# EAGLE schematic Qwiic_Adaptive_Switch_Output1.1 (EAGLE 9.6.2)
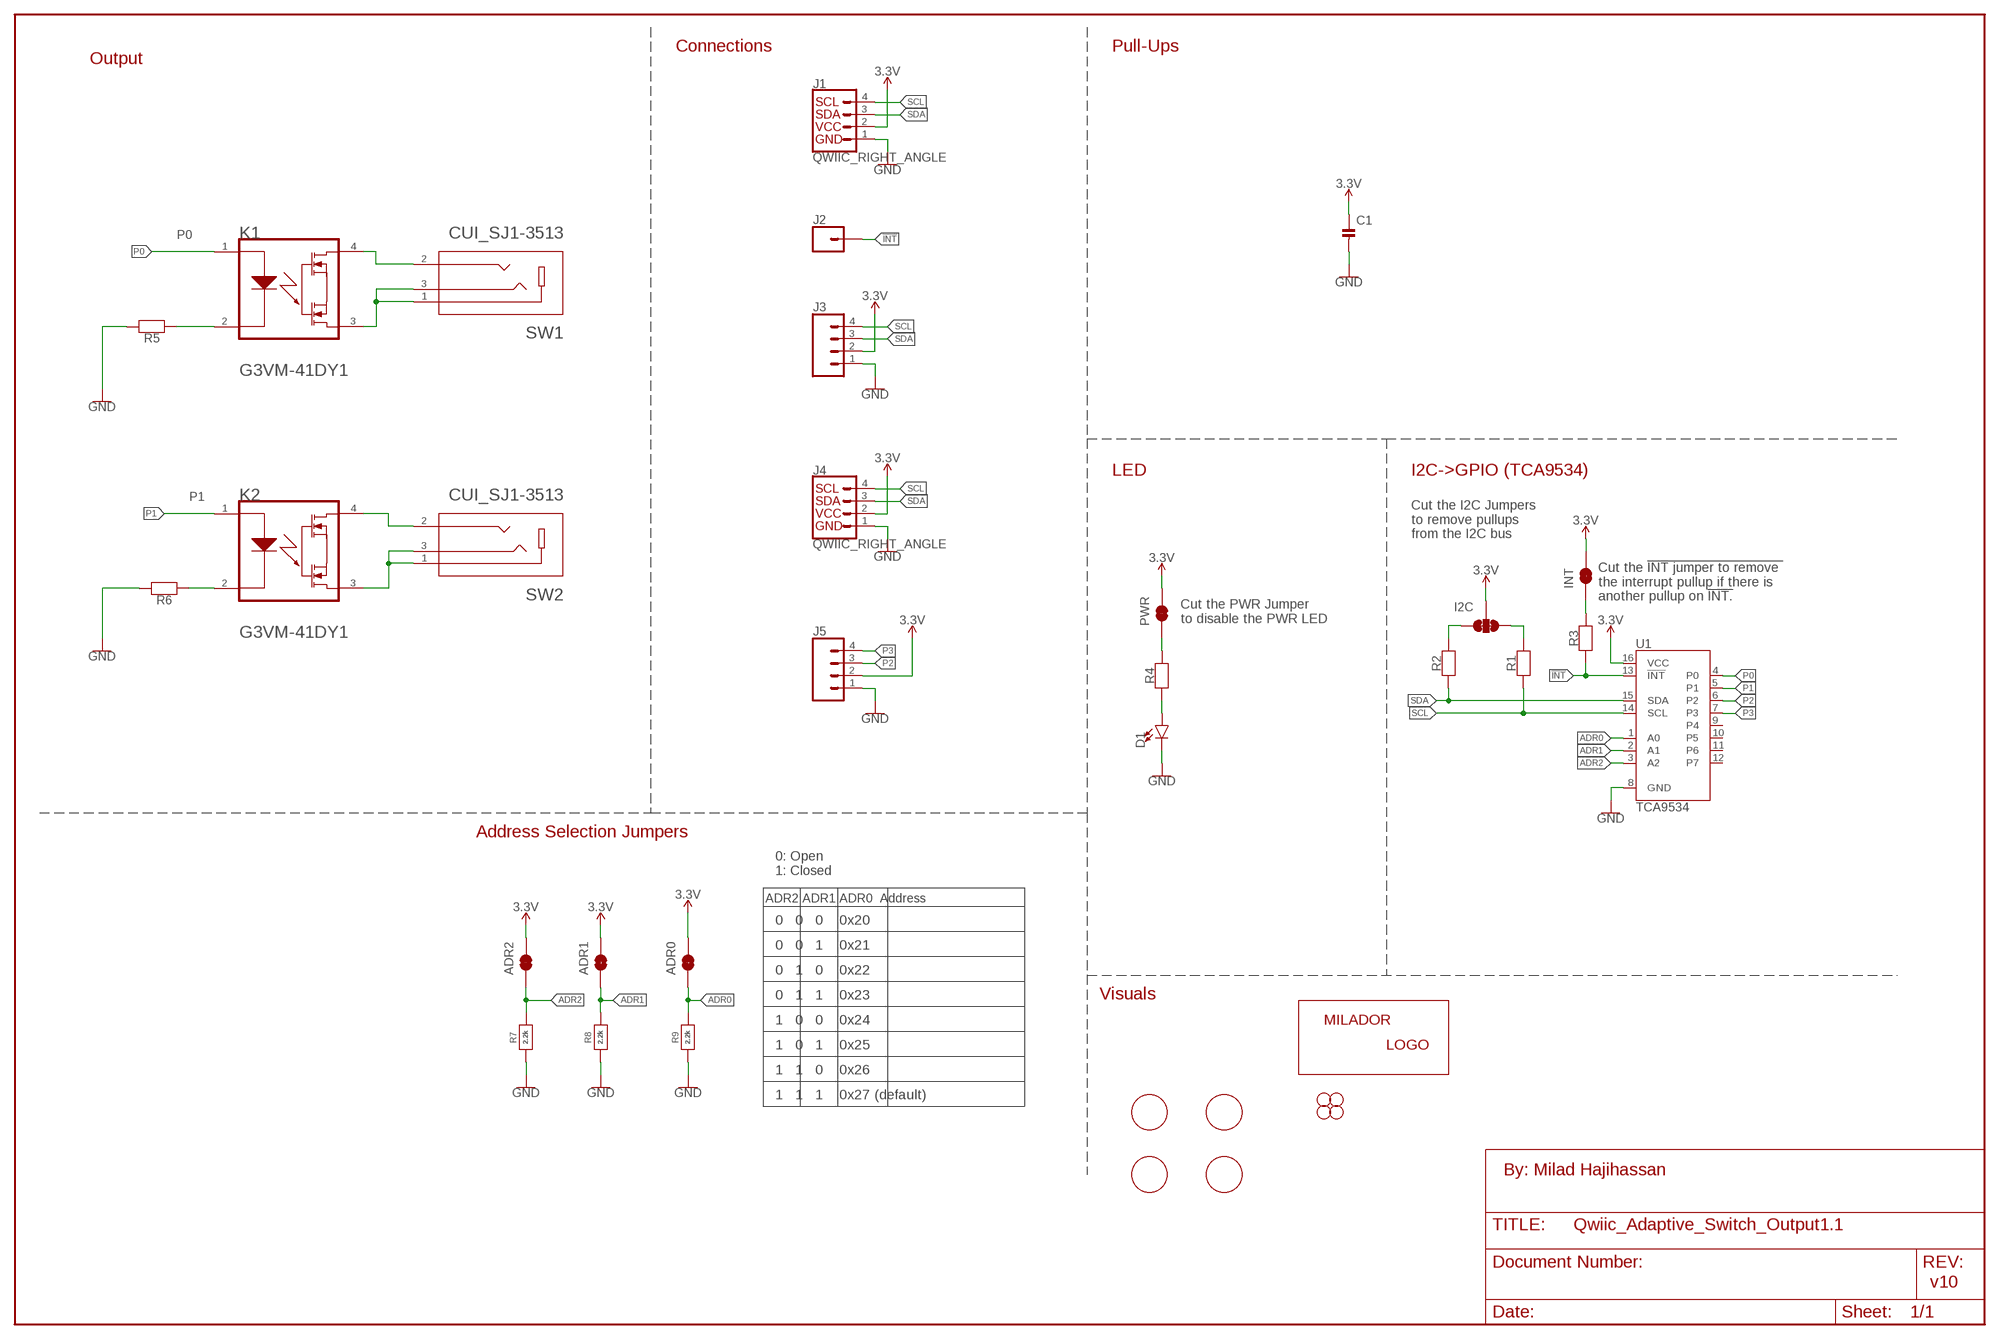
[diagram p0: schematic, sheet 1]

## Parts
ADR0  JUMPERS-SMT_2_NC_TRACE_SILK  [JUMPERS_SMT-JUMPER_2_NC_TRACE_SILK]
ADR1  JUMPERS-SMT_2_NC_TRACE_SILK  [JUMPERS_SMT-JUMPER_2_NC_TRACE_SILK]
ADR2  JUMPERS-SMT_2_NC_TRACE_SILK  [JUMPERS_SMT-JUMPER_2_NC_TRACE_SILK]
C1  0.1uF  CAP_CERAMIC-0805-MP  [0805-MP]
D1  RED  LED0805_NOOUTLINE  [CHIPLED_0805_NOOUTLINE]
H1  STAND-OFF-3.3  [STAND-OFF-3.3]
H2  STAND-OFF-3.3  [STAND-OFF-3.3]
I2C  JUMPERS_JUMPER-SMT_3_2-NC_TRACE_SILK  [JUMPERS_SMT-JUMPER_3_2-NC_TRACE_SILK]
INT  JUMPERS-SMT_2_NC_TRACE_SILK  [JUMPERS_SMT-JUMPER_2_NC_TRACE_SILK]
J1  QWIIC_RIGHT_ANGLE  QWIIC_CONNECTORSJS-1MM  [CONNECTORS_JST04_1MM_RA]
J2  CONNECTORS_CONN_01PTH_NO_SILK_YES_STOP  [CONNECTORS_1X01_NO_SILK]
J3  CONNECTORS_CONN_041X04_NO_SILK  [CONNECTORS_1X04_NO_SILK]
J4  QWIIC_RIGHT_ANGLE  QWIIC_CONNECTORSJS-1MM  [CONNECTORS_JST04_1MM_RA]
J5  CONNECTORS_CONN_041X04_NO_SILK  [CONNECTORS_1X04_NO_SILK]
JP3  STAND-OFF-3.3  [STAND-OFF-3.3]
JP4  STAND-OFF-3.3  [STAND-OFF-3.3]
K1  G3VM-41DY1  [G3VM-41DY1]
K2  G3VM-41DY1  [G3VM-41DY1]
LABEL_2  MILADOR-SWITCH-NAME-SW1  [SWITCH-SW1]
LABEL_3  MILADOR-SWITCH-NAME-SW2  [SWITCH-SW2]
LABEL_9  MILADOR-SWITCH-NAME-SW-OUTPUT  [SWITCH-OUTPUT]
LABEL_13  MILADOR-LOGO-  [MILADOR_LOGO1]
LABEL_18  MILADOR-SWITCH-NAME-SW-OUTPUT  [SWITCH-OUTPUT]
PWR  JUMPERS-SMT_2_NC_TRACE_SILK  [JUMPERS_SMT-JUMPER_2_NC_TRACE_SILK]
R1  2.2k  RESISTOR-0805-MP  [0805-MP]
R2  2.2k  RESISTOR-0805-MP  [0805-MP]
R3  10k  RESISTOR-0805-MP  [0805-MP]
R4  1k  RESISTOR-0805-MP  [0805-MP]
R5  220  RESISTOR-0805-MP  [0805-MP]
R6  220  RESISTOR-0805-MP  [0805-MP]
R7  2.2k  RESISTOR-0805-MP  [0805-MP]
R8  2.2k  RESISTOR-0805-MP  [0805-MP]
R9  2.2k  RESISTOR-0805-MP  [0805-MP]
SW1  CUI_SJ1-3513  [CUI_SJ1-3513]
SW2  CUI_SJ1-3513  [CUI_SJ1-3513]
U1  TCA9534  TCA9534DWR  [16SOIC]

## Nets
3.3V: ADR0.2 ADR1.2 ADR2.2 C1.1 I2C.2 INT.2 J1.2 J3.2 J4.2 J5.2 PWR.2 U1.16(VCC)
!INT: J2.1 R3.1 U1.13(!INT)
ADR0: ADR0.1 R9.2 U1.1(A0)
ADR1: ADR1.1 R8.2 U1.2(A1)
ADR2: ADR2.1 R7.2 U1.3(A2)
GND: C1.2 D1.C J1.1 J3.1 J4.1 J5.1 R5.2 R6.2 R7.1 R8.1 R9.1 U1.8(GND)
N$1: INT.1 R3.2
N$2: D1.A R4.1
N$3: PWR.1 R4.2
N$4: K1.4 SW1.2
N$5: K1.2 R5.1
N$6: K1.3 SW1.1 SW1.3
N$7: K2.2 R6.1
N$8: K2.4 SW2.2
N$9: K2.3 SW2.1 SW2.3
P0: K1.1 U1.4(P0)
P1: K2.1 U1.5(P1)
P2: J5.3 U1.6(P2)
P3: J5.4 U1.7(P3)
SCL: J1.4 J3.4 J4.4 R1.1 U1.14(SCL)
SCL_PU1: I2C.1 R2.2
SDA: J1.3 J3.3 J4.3 R2.1 U1.15(SDA)
SDA_PU1: I2C.3 R1.2
Unconnected: U1.9(P4) U1.10(P5) U1.11(P6) U1.12(P7)

## Notes on the sheet
- Connections | Pull-Ups
- Output
- LED | I2C->GPIO (TCA9534)
- Cut the I2C Jumpers 
  to remove pullups 
  from the I2C bus
- Cut the !INT jumper to remove 
  the interrupt pullup if there is 
  another pullup on !INT.
- Cut the PWR Jumper
  to disable the PWR LED
- Address Selection Jumpers
- 0: Open
  1: Closed
- ADR2 ADR1 ADR0  Address
- 0   0   0    0x20
- 0   0   1    0x21
- 0   1   0    0x22
- 0   1   1    0x23 | Visuals
- 1   0   0    0x24
- 1   0   1    0x25
- 1   1   0    0x26
- 1   1   1    0x27 (default)
- By: Milad Hajihassan
- v10

## Library data of the parts
ADR0 ADR1 ADR2 INT PWR = milador_SMD:JUMPERS-SMT_2_NC_TRACE: Normally closed trace jumper This jumper has a trace between two pads so it's normally closed (NC). Use a razor knife to open the connection. For best results follow the IPC guidelines for cutting traces: Cutout at least 0.063 mm (0.005 in). Remove all loose material to clean up the cut area. Seal the cut with an approved epoxy. Reapply solder to reclose the connection.
C1 = milador_SMD:CAP_CERAMIC-: Ceramic Capacitors For new designs, use the packages preceded by an '_' character since they are more reliable: The following footprints should be used on most boards: _0402 - Standard footprint for regular board layouts _0603 - Standard footprint for regular board layouts _0805 - Standard footprint for regular board layouts _1206 - Standard footprint for regular board layouts For extremely tight-pitch boards where space is at a premium, the following 'micro-pitch' footprints can be used (smaller pads, no silkscreen outline, etc.): _0402MP - Micro-pitch footprint for very dense/compact boards _0603MP - Micro-pitch footprint for very dense/compact boards _0805MP - Micro-pitch footprint for very dense/compact boards _1206MP - Micro-pitch footprint for very dense/compact boards
D1 = milador_SMD:LED: LED 0603 - 0603 Surface Mount Package 2mA: Green LED - Low Power (3.9mcd, 2ma, 1.7Vf) - Digikey: 475-2709-2-ND Orange LED - Low Power (9.8mcd, 2ma, 1.8Vf) - Digikey: 475-1194-2-ND Red LED - Low Power (5mcd, 2ma, 1.8Vf) - Digikey: 475-1195-2-ND Yellow LED - Low Power (7mcd, 2ma, 1.8Vf) - Digikey: 475-1196-2-ND 5mA: Blue LED - Low Power (17mcd, 5ma, 2.9Vf) - Digikey: LNJ937W8CRACT-ND 0805 - 0805 Surface Mount Package 2mA: Red LED (8.8mcd, 2mA, 1.8Vf, Clear) - Low Power [Digikey: 475-2510-1-ND] Green LED (5mcd, 2mA, 1.8Vf, Clear) - Low Power [Digikey: 475-2730-1-ND] Yellow LED (11.3mcd, 2mA, 1.8Vf, Clear) - Low Power [Digikey: 475-2555-1-ND] 20mA: Red LED (104mcd, 20mA, Diffused) - LS R976 [Digikey: 475-1278-6-ND] Red LED (12mcd, 20mA, 2.0Vf, Clear) - APT2012EC [Digikey: 754-1128-1-ND] Green LED (15mcd, 20mA, 2.2Vf, Clear) - APT2012GC [Digikey: 754-1131-1-ND] Orange LED (160mcd, 20mA, 2.1Vf, Clear) - APT2012SECK [Digikey: 754-1130-1-ND] 1206 - 1206 Surface Mount Package Green LED (26mcd, 20mA, Diffused) - LG N971 [Digikey: 475-1407-6-ND] Red LED (15mcd, 20mA, Diffused) - LH N974 [Digikey: 475-1416-6-ND] Cree - Cree High-Power Surface Mount LEDs XPEBWT-L1-0000-00D50 - White 111lm 350mA 2.9Vf 6200K 110° XTEAWT-00-0000-00000LEE3 - White 114lm 350mA 2.85Vf 5000K 115° Everlight - Everlight 45-21 Series Surface Mount LEDs 45-21/QK2C-B2832AC2CB2/2T - Warm White 2000mcd 20mA 3.25Vf 3050K 120° 45-21/LK2C-B38452C4CB2/2T - Nuetral White 2000mcd 20mA 3.25Vf 4150K 120° 45-21/LK2C-B50634C6CB2/2T - Cold White 2200mcd 20mA 3.25Vf 5650K 120° PLCC2 Reverse Mount LS T77K-J1L2-1-0-2-R18-Z - Red 11.25mcd 2mA 1.8Vf 630nm 120° LO T77K-L1M2-24-Z - Orange 19.6mcd 2mA 1.8Vf 606nm 120° LY T77K-K2M1-26-Z - Yellow 15.7mcd 2mA 1.8Vf 587nm 120°
H1 H2 JP3 JP4 = milador:STAND-OFF-: Stand Off Drill holes for mechanically mounting via screws, standoffs, etc. Note: Use the keepout ring to avoid running the screw head into surrounding components. Variant Overviews STAND-OFF - Mechanical footprint for a #4 phillips button head screw. STAND-OFF-TIGHT - Mechanical footprint for a #4 phillips button head screw, Example SparkFun Products Screw - Phillips Head (1/4", 4-40, 10 pack) <https://www.sparkfun.com/products/10453> (PRT-10453) Screw - Phillips Head (1/2", 4-40, 10 pack) <https://www.sparkfun.com/products/10452> (PRT-10452) Screw - Phillips Head (3/4", 4-40, 10 pack) <https://www.sparkfun.com/products/10451> (PRT-10451) Screw - Phillips Head (1", 4-40, 10 pack) <https://www.sparkfun.com/products/10450> (PRT-10450)
I2C = milador_SMD:JUMPERS_JUMPER-SMT_3_2-NC_TRACE: Normally closed trace jumper (2 of 2 connections) This jumper has a trace between all three pads so they are normally closed (NC). Use a razor knife to open the connection(s). For best results follow the IPC guidelines for cutting traces: Cutout at least 0.063 mm (0.005 in). Remove all loose material to clean up the cut area. Seal the cut with an approved epoxy. Reapply solder to reclose the connection(s).
J1 J4 = milador_SMD:QWIIC_CONNECTORS: SparkFun I2C Standard Qwiic Connector An SMD 1mm pitch JST connector makes it easy and quick (get it? Qwiic?) to connect I2C devices to each other. The Qwiic system <http://www.sparkfun.com/qwiic> enables fast and solderless connection between popular platforms and various sensors and actuators. We carry 200mm <https://www.sparkfun.com/products/14204>, 100mm <https://www.sparkfun.com/products/14205>, 50mm <https://www.sparkfun.com/products/14206>, and breadboard friendly <https://www.sparkfun.com/products/14207> Qwiic cables. We also offer 10 pcs strips <https://www.sparkfun.com/products/14323> the SMD connectors.; PROD_ID: CONN-13694
J2 = milador:CONNECTORS_CONN_01: Single connection point. Often used as Generic Header-pin footprint for 0.1 inch spaced/style header connections On any of the 0.1 inch spaced packages, you can populate with these: Break Away Headers - Straight <https://www.sparkfun.com/products/116> (PRT-00116) Break Away Male Headers - Right Angle <https://www.sparkfun.com/products/553> (PRT-00553) Female Headers <https://www.sparkfun.com/products/115> (PRT-00115) Break Away Headers - Machine Pin <https://www.sparkfun.com/products/117> (PRT-00117) Break Away Female Headers - Swiss Machine Pin <https://www.sparkfun.com/products/743> (PRT-00743) This device is also useful as a general connection point to wire up your design to another part of your project. Our various solder wires solder well into these plated through hole pads. Hook-Up Wire - Assortment (Stranded, 22 AWG) <https://www.sparkfun.com/products/11375> (PRT-11375) Hook-Up Wire - Assortment (Solid Core, 22 AWG) <https://www.sparkfun.com/products/11367> (PRT-11367) View the entire wire category on our website here <https://www.sparkfun.com/categories/141> Special notes: SMTSO-256-ET is a "flush mount" nut for a 4-40 screw. We mostly use this on specialty testbeds; it is a nice way to connect hardware to your PCB at an adjustable hieght. Also note, the SNAP packages are for using a snappable style connector. We sell a baggie of snaps and they are also used on two LilyPad designs: Snap Assortment - 30 pack (male and female) <https://www.sparkfun.com/products/11347> (DEV-11347) LilyPad Arduino SimpleSnap <https://www.sparkfun.com/products/10941> (DEV-10941) LilyPad SimpleSnap Protoboard <https://www.sparkfun.com/products/10940> (DEV-10940)
J3 J5 = milador:CONNECTORS_CONN_04: Multi connection point. Often used as Generic Header-pin footprint for 0.1 inch spaced/style header connections On any of the 0.1 inch spaced packages, you can populate with these: Break Away Headers - Straight <https://www.sparkfun.com/products/116> (PRT-00116) Break Away Male Headers - Right Angle <https://www.sparkfun.com/products/553> (PRT-00553) Female Headers <https://www.sparkfun.com/products/115> (PRT-00115) Break Away Headers - Machine Pin <https://www.sparkfun.com/products/117> (PRT-00117) Break Away Female Headers - Swiss Machine Pin <https://www.sparkfun.com/products/743> (PRT-00743) For SCREWTERMINALS and SPRING TERMINALS visit here: Screw Terimnals on SparkFun.com <https://www.sparkfun.com/search/results?term=Screw+Terminals> (5mm/3.5mm/2.54mm spacing) This device is also useful as a general connection point to wire up your design to another part of your project. Our various solder wires solder well into these plated through hole pads. Hook-Up Wire - Assortment (Stranded, 22 AWG) <https://www.sparkfun.com/products/11375> (PRT-11375) Hook-Up Wire - Assortment (Solid Core, 22 AWG) <https://www.sparkfun.com/products/11367> (PRT-11367) View the entire wire category on our website here <https://www.sparkfun.com/categories/141> Special notes: Molex polarized connector foot print use with SKU : PRT-08231 with associated crimp pins and housings. 1MM SMD Version SKU: PRT-10208; PROD_ID: CONN-09696
K1 K2 = milador_SMD:G3VM-41DY1: G3VM-41DY1(TR05)
LABEL_2 LABEL_3 LABEL_9 LABEL_18 = milador:MILADOR-SWITCH-NAME-
LABEL_13 = milador:MILADOR-LOGO-
R1-R9 = milador_SMD:RESISTOR-: Resistors For new designs, use the packages preceded by an '_' character since they are more reliable: The following footprints should be used on most boards: _0402 - Standard footprint for regular board layouts _0603 - Standard footprint for regular board layouts _0805 - Standard footprint for regular board layouts _1206 - Standard footprint for regular board layouts For extremely tight-pitch boards where space is at a premium, the following 'micro-pitch' footprints can be used (smaller pads, no silkscreen outline, etc.): _0402MP - Micro-pitch footprint for very dense/compact boards _0603MP - Micro-pitch footprint for very dense/compact boards _0805MP - Micro-pitch footprint for very dense/compact boards _1206MP - Micro-pitch footprint for very dense/compact boards
SW1 SW2 = MMC Eagle:CUI_SJ1-3513: SJ1-3513 3.50mm (0.141", 1/8", Mini Plug) - Headphone Phone Jack Stereo (3 Conductor, TRS) Connector. You can use these as jacks to create simple switch interfaces. Options: Digikey - CP1-3513-ND <https://www.digikey.ca/en/products/detail/SJ1-3513/CP1-3513-ND/738683> Mouser - 490-SJ1-3513 <https://www.mouser.ca/ProductDetail/CUI-Devices/SJ1-3513?qs=WyjlAZoYn505QJhcTd1fzA==>
U1 = milador_SMD:TCA9534: Texas Instruments TCA9534 I2C -> GPIO Expander This I2C -> GPIO Expander allows you to attach 8 GPIO to your I2C bus. With 8 different addresses, up to 64 GPIO are possible on one I2C bus; PROD_ID: IC-14889